# Altium schematic sheet S02.SchDoc: Quad Linear Amplifier
size 381 x 254 mm; Revision: 1.4; SheetNumber: 2; SheetTotal: 9; PageSetup: Record=PageOptions|CenterHorizontal=True|CenterVertical=True|PrintScale=0.72|XCorrection=1.00|YCorrection=1.00|PrintKind=1|BorderSize=5000000|LeftOffset=0|BottomOffset=0|Orientation=2|PaperLength=1000|PaperWidth=1000|Scale=100|PaperSource=7|PrintQuality=1200|MediaType=1|DitherType=10|PaperKind=Letter|PrintScaleMode=1
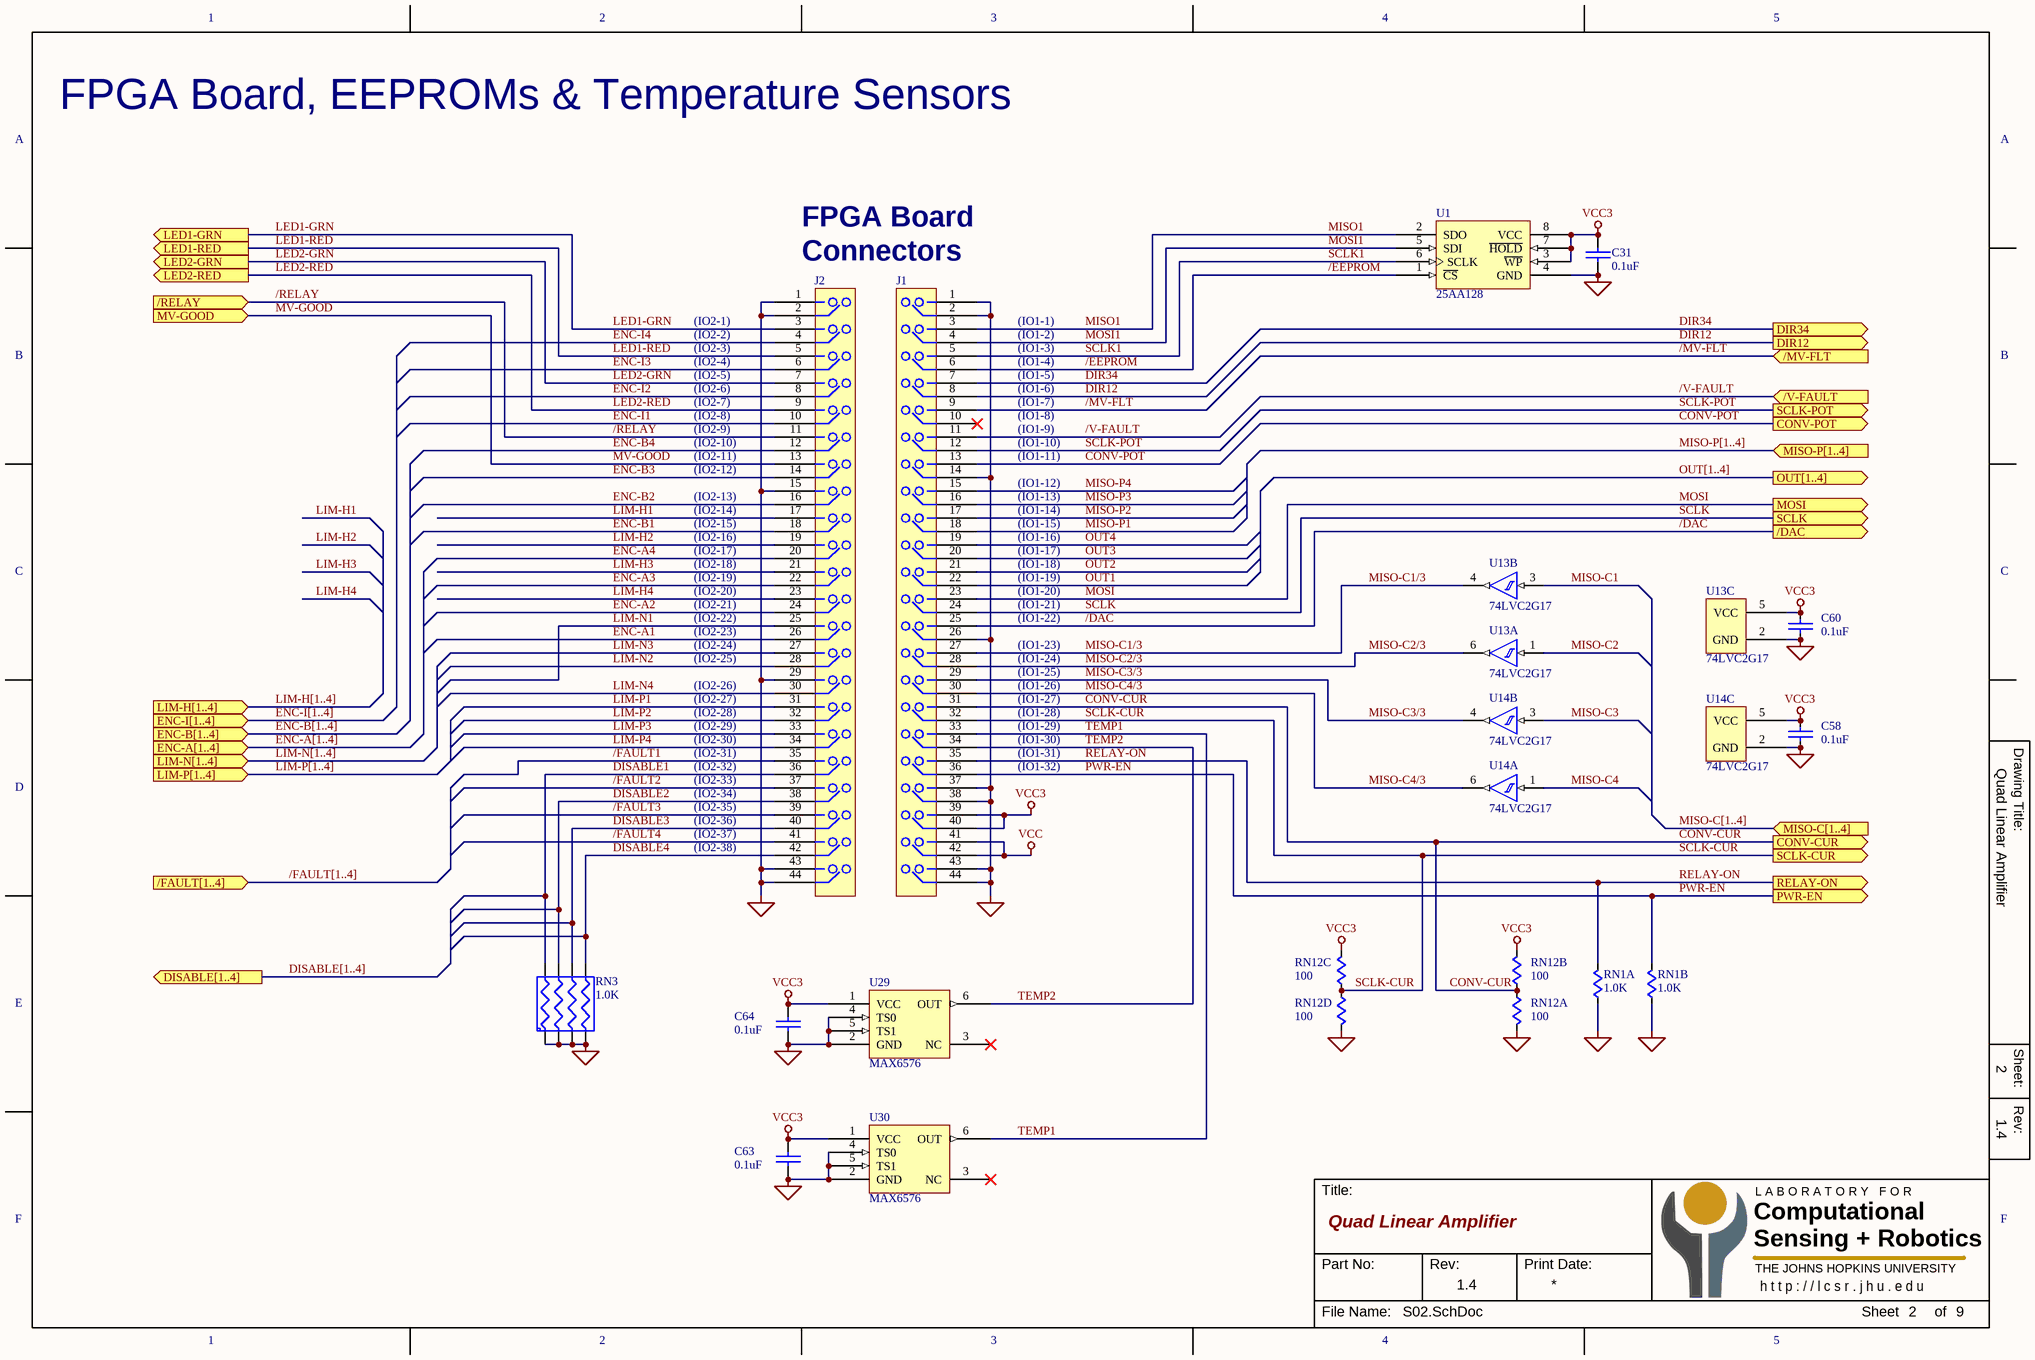
[diagram p0: S02.SchDoc]

## Parts
C31  0.1uF  [C0603]
C58  0.1uF  [C0603]
C60  0.1uF  [C0603]
C63  0.1uF  [C0603]
C64  0.1uF  [C0603]
J1  HEADER 22x2-1  [HDR-22x2-2MM]  (value not drawn)
J2  HEADER 22x2-1  [HDR-22x2-2MM]  (value not drawn)
RN1  1.0K  [RN-742C083]  (parts A,B of 4)
RN3  1.0K  [RN-742C083]
RN12  100  [RN-742C083]  (parts A,B,C,D of 4)
U1  25AA128  [TSSOP-8]
U13  74LVC2G17  [SOT-23-6]  (parts A,B,C of 3)
U14  74LVC2G17  [SOT-23-6]  (parts A,B,C of 3)
U29  MAX6576  [SOT-23-6]
U30  MAX6576  [SOT-23-6]

## Ports
/DAC (out), /FAULT[1..4] (in), /MV-FLT (in), /RELAY (in), /V-FAULT (in), CONV-CUR (out), CONV-POT (out), DIR12 (out), DIR34 (out), DISABLE[1..4] (out), ENC-A[1..4] (in), ENC-B[1..4] (in), ENC-I[1..4] (in), LED1-GRN (out), LED1-RED (out), LED2-GRN (out), LED2-RED (out), LIM-H[1..4] (in), LIM-N[1..4] (in), LIM-P[1..4] (in), MISO-C[1..4] (in), MISO-P[1..4] (in), MOSI (out), MV-GOOD (in), OUT[1..4] (out), PWR-EN (out), RELAY-ON (out), SCLK (out), SCLK-CUR (out), SCLK-POT (out)

## Nets
GND: C31.2 C58.2 C60.2 C63.2 C64.2 J1.1 J1.2 J1.14 J1.26 J1.37 J1.38 J1.43 J1.44 J2.1 J2.2 J2.15 J2.29 J2.43 J2.44 RN1.1 RN1.2 RN3.1(R1) RN3.2(R2.1) RN3.3(R3.1) RN3.4(R4.1) RN12.5 RN12.8 U1.4(GND) U13.2(GND) U14.2(GND) U29.2(GND) U29.4(TS0) U29.5(TS1) U30.2(GND) U30.4(TS0) U30.5(TS1)
VCC: J1.41 J1.42
VCC3: C31.1 C58.1 C60.1 C63.1 C64.1 J1.39 J1.40 RN12.6 RN12.7 U1.3(~{WP}) U1.7(~{HOLD}) U1.8(VCC) U13.5(VCC) U14.5(VCC) U29.1(VCC) U30.1(VCC)
/DAC: J1.25 ; port /DAC
/EEPROM: J1.6 U1.1(~{CS})
/FAULT1: J2.35
/FAULT2: J2.37
/FAULT3: J2.39
/FAULT4: J2.41
/MV-FLT: J1.9 ; port /MV-FLT
/RELAY: J2.11 ; port /RELAY
/V-FAULT: J1.11 ; port /V-FAULT
CONV-CUR: J1.31 RN12.1 RN12.2 ; port CONV-CUR
CONV-POT: J1.13 ; port CONV-POT
DIR12: J1.8 ; port DIR12
DIR34: J1.7 ; port DIR34
DISABLE1: J2.36 RN3.8(R1.2)
DISABLE2: J2.38 RN3.7(R2.2)
DISABLE3: J2.40 RN3.6(R3.2)
DISABLE4: J2.42 RN3.5(R4.2)
ENC-A1: J2.26
ENC-A2: J2.24
ENC-A3: J2.22
ENC-A4: J2.20
ENC-B1: J2.18
ENC-B2: J2.16
ENC-B3: J2.14
ENC-B4: J2.12
ENC-I1: J2.10
ENC-I2: J2.8
ENC-I3: J2.6
ENC-I4: J2.4
LED1-GRN: J2.3 ; port LED1-GRN
LED1-RED: J2.5 ; port LED1-RED
LED2-GRN: J2.7 ; port LED2-GRN
LED2-RED: J2.9 ; port LED2-RED
LIM-H1: J2.17
LIM-H2: J2.19
LIM-H3: J2.21
LIM-H4: J2.23
LIM-N1: J2.25
LIM-N2: J2.28
LIM-N3: J2.27
LIM-N4: J2.30
LIM-P1: J2.31
LIM-P2: J2.32
LIM-P3: J2.33
LIM-P4: J2.34
MISO1: J1.3 U1.2(SDO)
MISO-C1: U13.3
MISO-C1/3: J1.27 U13.4
MISO-C2: U13.1
MISO-C2/3: J1.28 U13.6
MISO-C3: U14.3
MISO-C3/3: J1.29 U14.4
MISO-C4: U14.1
MISO-C4/3: J1.30 U14.6
MISO-P1: J1.18
MISO-P2: J1.17
MISO-P3: J1.16
MISO-P4: J1.15
MOSI: J1.23 ; port MOSI
MOSI1: J1.4 U1.5(SDI)
MV-GOOD: J2.13 ; port MV-GOOD
OUT1: J1.22
OUT2: J1.21
OUT3: J1.20
OUT4: J1.19
PWR-EN: J1.36 RN1.7 ; port PWR-EN
RELAY-ON: J1.35 RN1.8 ; port RELAY-ON
SCLK: J1.24 ; port SCLK
SCLK1: J1.5 U1.6(SCLK)
SCLK-CUR: J1.32 RN12.3 RN12.4 ; port SCLK-CUR
SCLK-POT: J1.12 ; port SCLK-POT
TEMP1: J1.33 U30.6(OUT)
TEMP2: J1.34 U29.6(OUT)

Not connected (* = marked no-connect by the designer): J1 10*; U29 3(NC)*; U30 3(NC)*

## Buses and harness runs
bus /FAULT[1..4] = port /FAULT[1..4]
bus DISABLE[1..4] = port DISABLE[1..4]
bus ENC-A[1..4] = port ENC-A[1..4]
bus ENC-B[1..4] = port ENC-B[1..4]
bus ENC-I[1..4] = port ENC-I[1..4]
bus LIM-H[1..4] = port LIM-H[1..4]
bus LIM-N[1..4] = port LIM-N[1..4]
bus LIM-P[1..4] = port LIM-P[1..4]
bus MISO-C[1..4] = port MISO-C[1..4]
bus MISO-P[1..4] = port MISO-P[1..4]
bus OUT[1..4] = port OUT[1..4]

## Notes on the sheet
- FPGA Board, EEPROMs & Temperature Sensors
- FPGA Board
- Connectors
- (IO2-1)
- (IO2-2)
- (IO2-3)
- (IO2-4)
- (IO1-1)
- (IO1-2)
- (IO1-3)
- (IO1-4)
- (IO2-5)
- (IO2-6)
- (IO2-7)
- (IO2-8)
- (IO2-9)
- (IO1-5)
- (IO1-6)
- (IO1-7)
- (IO1-8)
- (IO1-9)
- (IO2-10)
- (IO2-11)
- (IO2-12)
- (IO2-13)
- (IO1-10)
- (IO1-11)
- (IO1-12)
- (IO1-13)
- (IO2-14)
- (IO2-15)
- (IO2-16)
- (IO2-17)
- (IO2-18)
- (IO1-14)
- (IO1-15)
- (IO1-16)
- (IO1-17)
- (IO1-18)
- (IO2-19)
- (IO2-20)
- (IO2-21)
- (IO2-22)
- (IO2-23)
- (IO1-19)
- (IO1-20)
- (IO1-21)
- (IO1-22)
- (IO2-24)
- (IO2-25)
- (IO2-26)
- (IO2-27)
- (IO1-23)
- (IO1-24)
- (IO1-25)
- (IO1-26)
- (IO1-27)
- (IO2-28)
- (IO2-29)
- (IO2-30)
- (IO2-31)
- (IO2-32)
- (IO1-28)
- (IO1-29)
- (IO1-30)
- (IO1-31)
- (IO1-32)
- (IO2-33)
- (IO2-34)
- (IO2-35)
- (IO2-36)
- (IO2-37)
- (IO2-38)
- 1
- 2
- 3
- 4
- 5
- A
- B
- C
- Drawing Title:
- D
- E
- Sheet:
- Rev:
- F
- Title:
- Computational
- Sensing + Robotics
- L A B O R A T O R Y   F O R
- Part No:
- Print Date:
- THE JOHNS HOPKINS UNIVERSITY
- h t t p : / / l c s r . j h u . e d u
- File Name:
- Sheet
- of

## Library data of the parts
C31 C63 C64 = CAP
C58 C60 = CAP-MINI
J1 J2 = HEADER 22x2-1: System: Connector
RN1 RN12 = RN-DISC-SM-4X
RN3 = RN-DISC-SM-4
U13 U14 = 2G17: NC7WZ17